# EAGLE design power (EAGLE 8.5.0)
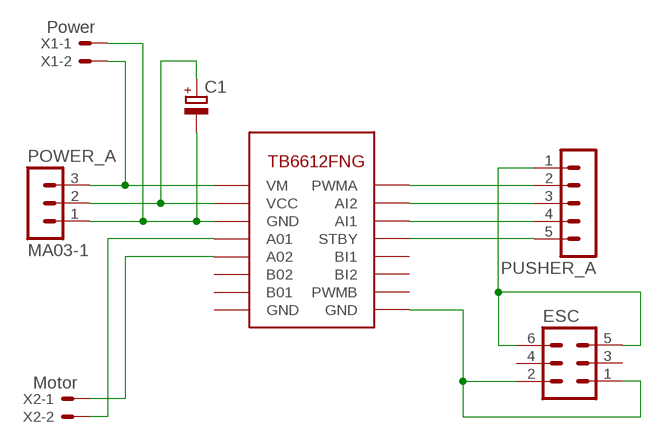
[diagram p0: schematic, sheet 1]

## Parts
C1  CPOL-EUTT5D7  [TT5D7]
ESC  MA03-2  [MA03-2]
POWER_A  MA03-1  [MA03-1]
PUSHER_A  MA05-1  [MA05-1]
U$2  TB6612FNG  [TB6612FNG]
X1  Power  JST-XH-02-PIN-ROUND-PAD  [JST-XH-02-PACKAGE-ROUND-PAD]
X2  Motor  JST-XH-02-PIN-ROUND-PAD  [JST-XH-02-PACKAGE-ROUND-PAD]

## Nets
N$1: U$2.P$4(A01) X2.2
N$2: U$2.P$5(A02) X2.1
N$3: PUSHER_A.4 U$2.P$14(AI1)
N$4: POWER_A.3 U$2.P$1(VM) X1.2
N$5: C1.- POWER_A.1 U$2.P$3(GND) X1.1
N$6: PUSHER_A.5 U$2.P$13(STBY)
N$8: PUSHER_A.3 U$2.P$15(AI2)
N$9: PUSHER_A.2 U$2.P$16(PWMA)
N$24: ESC.1 ESC.2 U$2.P$9(GND)
N$25: ESC.5 ESC.6 PUSHER_A.1
N$28: C1.+ POWER_A.2 U$2.P$2(VCC)
Unconnected: ESC.3 ESC.4 U$2.P$6(B02) U$2.P$7(B01) U$2.P$8(GND) U$2.P$10(PWMB) U$2.P$11(BI2) U$2.P$12(BI1)

## Library data of the parts
C1 = resistor:CPOL-EU: POLARIZED CAPACITOR, European symbol
ESC = con-lstb:MA03-2: PIN HEADER; OC_FARNELL: unknown; OC_NEWARK: unknown
POWER_A = con-lstb:MA03-1
PUSHER_A = con-lstb:MA05-1: PIN HEADER; OC_FARNELL: unknown; OC_NEWARK: unknown
U$2 = mylib:TB6612FNG
X1 X2 = Rembrandt Electronics - JST XH Connectors v1-0:JST-XH-02-PIN: JST XH Connector 2 Pin Wire to board connector. Pitch: 2,54 mm, (0.100") Number of pins: 2 Created by Rembrandt Electronics www.rembrandtelectronics.com

## Net classes
0 default: clearance 0.205 mm

## Board
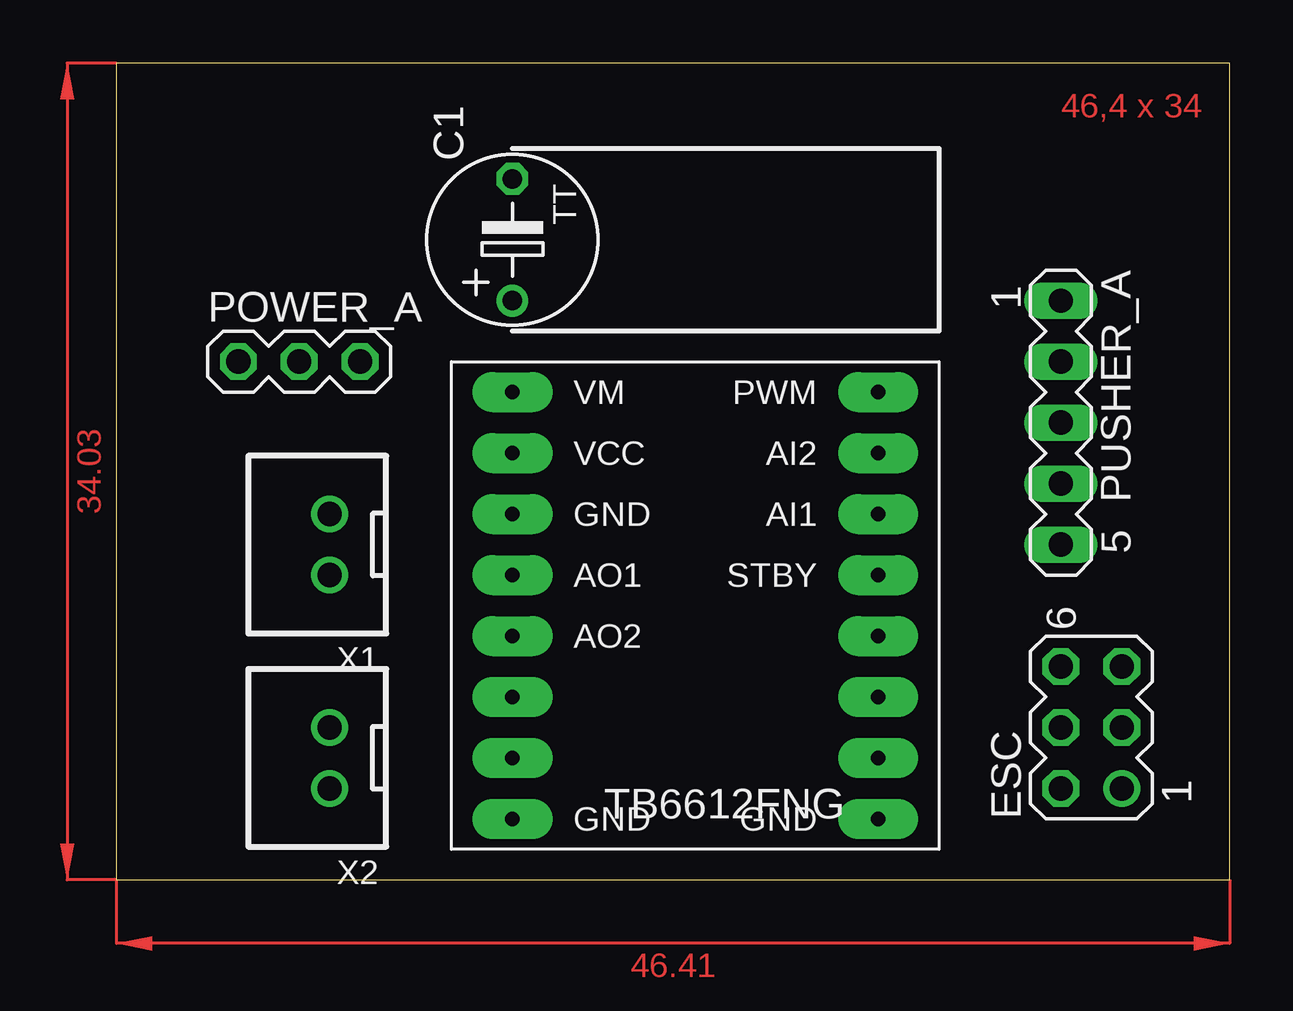
[diagram p1: board, top side]
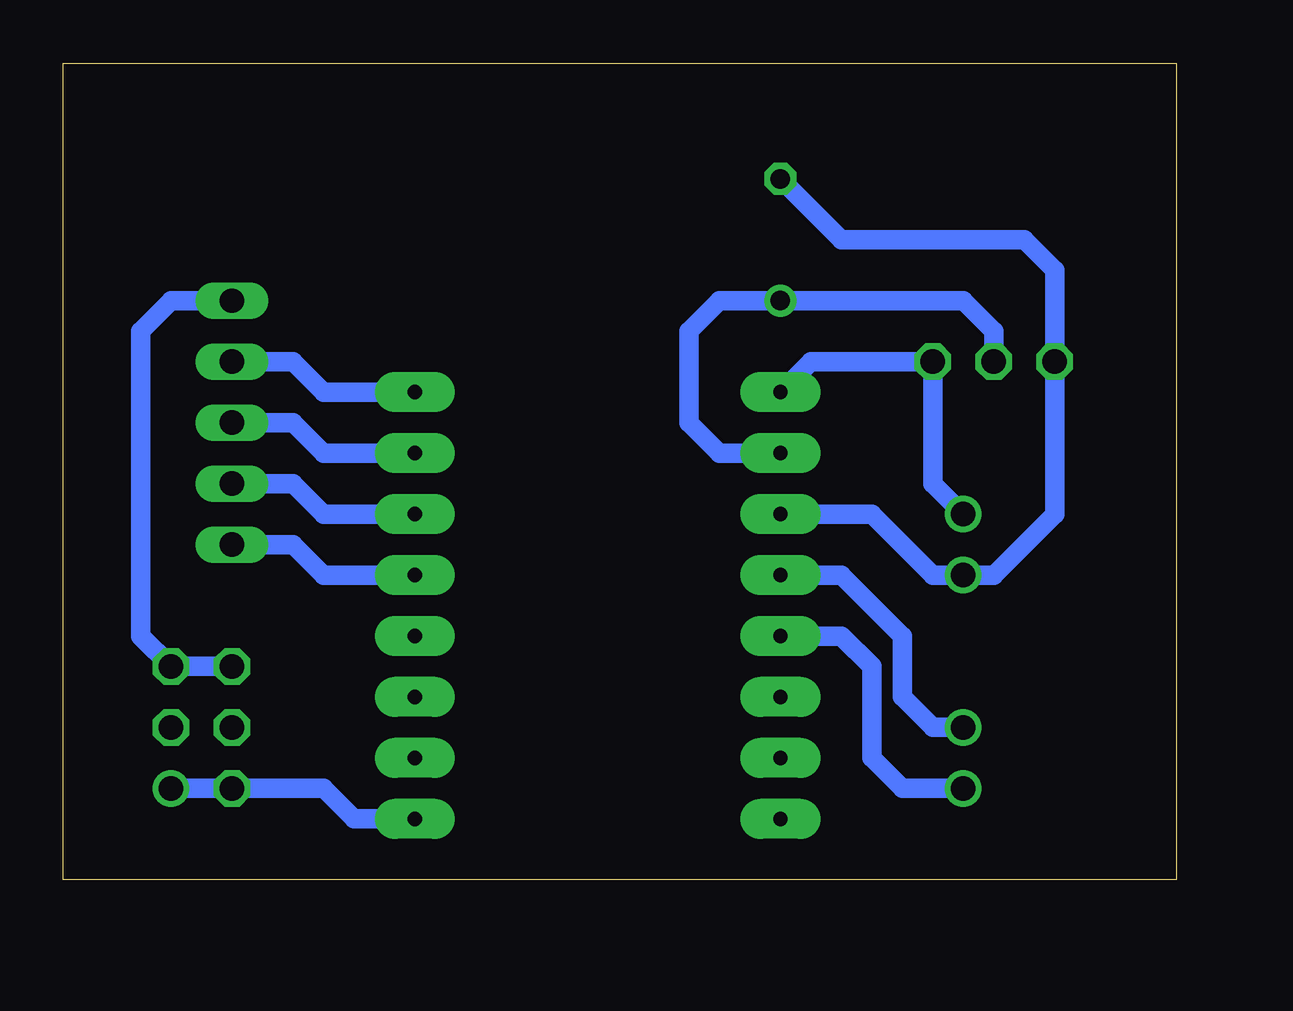
[diagram p2: board, bottom side, seen from below]

Size 46.41 x 34.03 mm. Coordinates in mm from the lower left corner, seen from the top.
Outline: 0,0 46.41,0 46.41,34.03 0,34.03 0,0
Copper layers (1*16): Top 0.035mm / dielectric 1.5mm / Bottom 0.035mm
Design rules "default": minimum track width 6mil, minimum drill 0.35mm, track to track 6mil, track to pad 6mil, pad to pad 6mil, via to via 6mil, smd to smd 6mil, copper to edge 40mil, drill to drill 6mil, minimum pad ring 10mil, minimum via ring 8mil, stop-mask expansion 4mil, vias tented up to drill 0mil, thermal gap 10mil

### Footprints (pad centres in the part's own frame; a part is rotated, then mirrored left to right if it is on the bottom)
TT5D7 = drill 0.813: + -2.54,0 | drill 0.813 octagon: - 2.54,0
MA03-2 = drill 1.016: 1 -2.54,-1.27 | drill 1.016 octagon: 2 -2.54,1.27; 3 0,-1.27; 4 0,1.27; 5 2.54,-1.27; 6 2.54,1.27
MA03-1 = drill 1.016 octagon: 1 -2.54,0; 2 0,0; 3 2.54,0
MA05-1 = drill 1.016 long: 1 -5.08,0; 2 -2.54,0; 3 0,0; 4 2.54,0; 5 5.08,0
TB6612FNG = drill 0.6 pad 1.676 long: P$1 -7.62,10.16; P$2 -7.62,7.62; P$3 -7.62,5.08; P$4 -7.62,2.54; P$5 -7.62,0; P$6 -7.62,-2.54; P$7 -7.62,-5.08; P$8 -7.62,-7.62; P$9 7.62,-7.62; P$10 7.62,-5.08; P$11 7.62,-2.54; P$12 7.62,0; P$13 7.62,2.54; P$14 7.62,5.08; P$15 7.62,7.62; P$16 7.62,10.16
JST-XH-02-PACKAGE-ROUND-PAD = drill 1.016: 1 -1.27,0; 2 1.27,0

### Placement (x,y rotation side)
C1  16.51,26.67 90 top
ESC  40.64,6.35 90 top
POWER_A  7.62,21.59 0 top
PUSHER_A  39.37,19.05 270 top
U$2  24.13,10.16 0 top
X1  8.89,13.97 90 top
X2  8.89,5.08 90 top

### Tracks (layer width: path | path; a pad name or v marks a point on that pad's centre or on a via)
N$1
  Bottom 0.813: U$2.P$4 13.97,12.7 11.43,10.16 11.43,7.62 10.16,6.35 X2.2
N$2
  Bottom 0.813: U$2.P$5 13.97,10.16 12.7,8.89 12.7,5.08 11.43,3.81 X2.1
N$3
  Bottom 0.813: U$2.P$14 35.56,15.24 36.83,16.51 PUSHER_A.4
N$4
  Bottom 0.813: U$2.P$1 15.24,21.59 POWER_A.3 10.16,16.51 X1.2
N$5
  Bottom 0.813: U$2.P$3 12.7,15.24 10.16,12.7 X1.1 7.62,12.7 5.08,15.24 POWER_A.1 5.08,25.4 6.35,26.67 13.97,26.67 C1.-
N$6
  Bottom 0.813: U$2.P$13 35.56,12.7 36.83,13.97 PUSHER_A.5
N$8
  Bottom 0.813: PUSHER_A.3 36.83,19.05 35.56,17.78 U$2.P$15
N$9
  Bottom 0.813: PUSHER_A.2 36.83,21.59 35.56,20.32 U$2.P$16
N$24
  Bottom 0.813: ESC.1 ESC.2 35.56,3.81 34.29,2.54 U$2.P$9
N$25
  Bottom 0.813: ESC.6 ESC.5 43.18,10.16 43.18,22.86 41.91,24.13 PUSHER_A.1
N$28
  Bottom 0.813: POWER_A.2 7.62,22.86 8.89,24.13 C1.+ 19.05,24.13 20.32,22.86 20.32,19.05 19.05,17.78 U$2.P$2
(copper drawn outside any net)
  shapes: Top area x2

### Text on the board
Top: 46,4 x 34
tPlace: VM | PWM | VCC | AI2 | GND | AI1 | AO1 | STBY | AO2 | GND | GND